# Altium schematic sheet ISB_V2.SchDoc
size A4
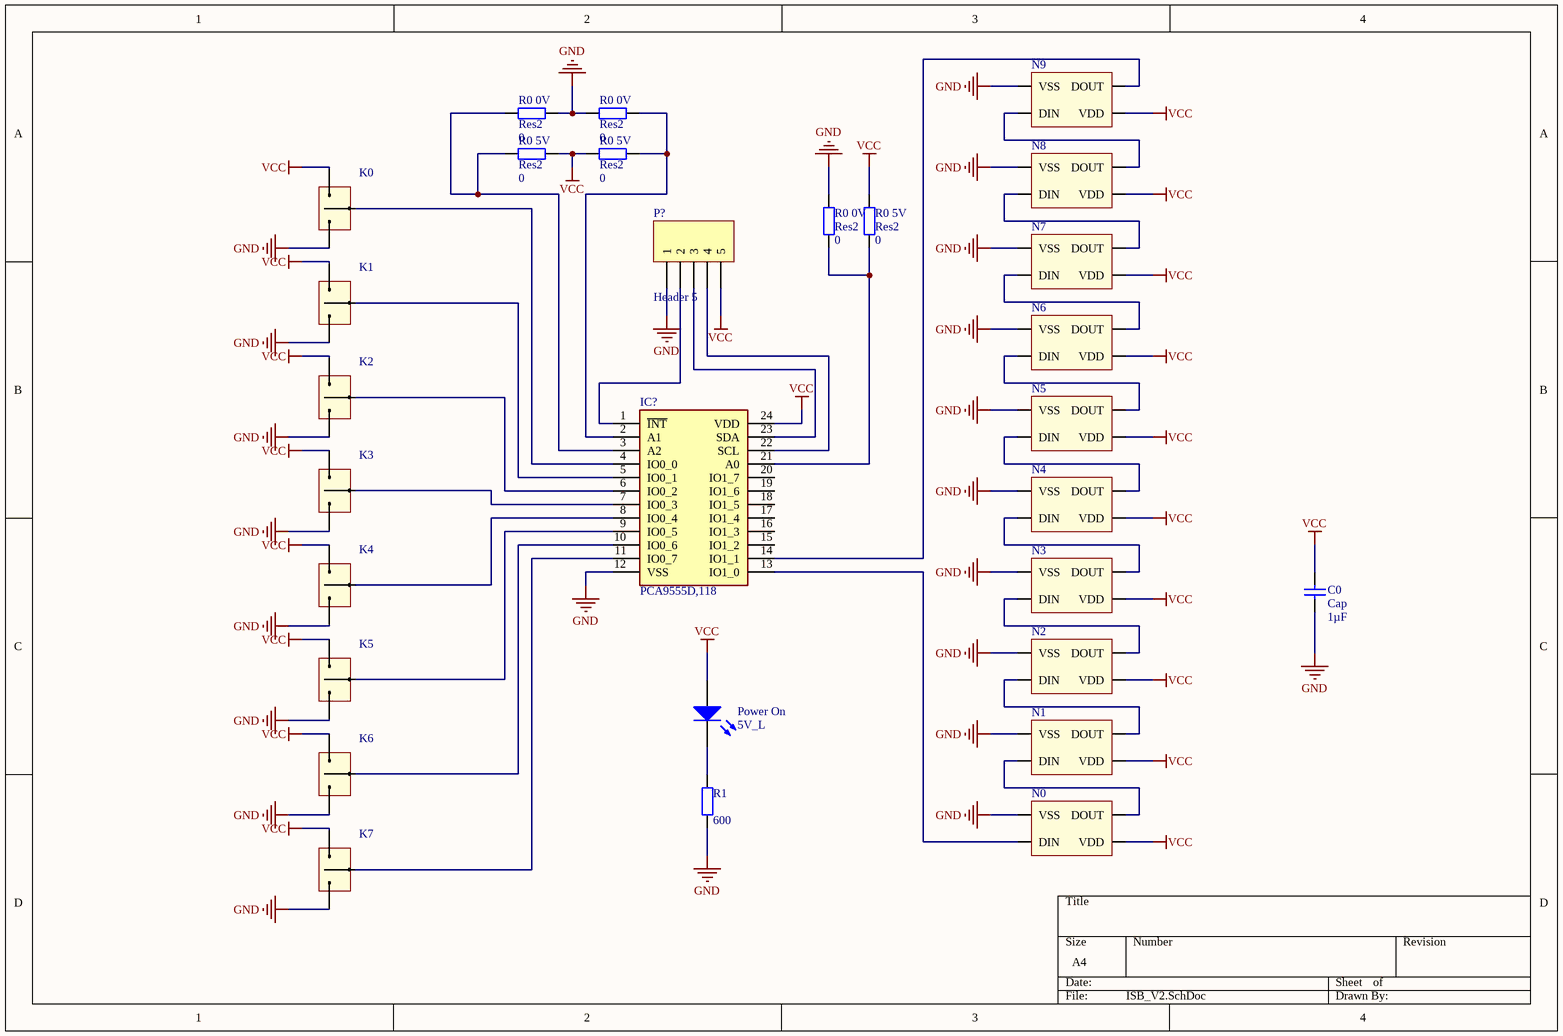
[diagram p0: ISB_V2.SchDoc]

## Parts
(Parts that share a designator on the sheet are numbered #1, #2 ... from top to bottom, then left to right.)
C0  Cap  value 1µF  [Capacitor 1206]
IC?  PCA9555D,118  [SOIC127P1032X265-24N]
K0  Switch  [SWITCH]  (value not drawn)
K1  Switch  [SWITCH]  (value not drawn)
K2  Switch  [SWITCH]  (value not drawn)
K3  Switch  [SWITCH]  (value not drawn)
K4  Switch  [SWITCH]  (value not drawn)
K5  Switch  [SWITCH]  (value not drawn)
K6  Switch  [SWITCH]  (value not drawn)
K7  Switch  [SWITCH]  (value not drawn)
N0  (no value)  [Neopixel]
N1  (no value)  [Neopixel]
N2  (no value)  [Neopixel]
N3  (no value)  [Neopixel]
N4  (no value)  [Neopixel]
N5  (no value)  [Neopixel]
N6  (no value)  [Neopixel]
N7  (no value)  [Neopixel]
N8  (no value)  [Neopixel]
N9  (no value)  [Neopixel]
P?  Header 5  [JST-XH 5]
Power_On  5V_L  [KP-3216SEC]
R0_0V#1  Res2  value 0  [Resistor 1206]
R0_0V#2  Res2  value 0  [Resistor 1206]
R0_0V#3  Res2  value 0  [Resistor 1206]
R0_5V#1  Res2  value 0  [Resistor 1206]
R0_5V#2  Res2  value 0  [Resistor 1206]
R0_5V#3  Res2  value 0  [Resistor 1206]
R1  value 600  [Resistor 1206]  (hidden comment: Res2)

## Nets
GND: C0.1 IC?.12(VSS) K0.2(R) K1.2(R) K2.2(R) K3.2(R) K4.2(R) K5.2(R) K6.2(R) K7.2(R) N0.2(VSS) N1.2(VSS) N2.2(VSS) N3.2(VSS) N4.2(VSS) N5.2(VSS) N6.2(VSS) N7.2(VSS) N8.2(VSS) N9.2(VSS) P?.1 R0_0V#1.1 R0_0V#2.2 R0_0V#3.2 R1.1
VCC: C0.2 IC?.24(VDD) K0.0(L) K1.0(L) K2.0(L) K3.0(L) K4.0(L) K5.0(L) K6.0(L) K7.0(L) N0.4(VDD) N1.4(VDD) N2.4(VDD) N3.4(VDD) N4.4(VDD) N5.4(VDD) N6.4(VDD) N7.4(VDD) N8.4(VDD) N9.4(VDD) P?.5 Power_On.1(A) R0_5V#1.2 R0_5V#2.2 R0_5V#3.2
NetIC?_1: IC?.1(~{INT}) P?.2
NetIC?_2: IC?.2(A1) R0_0V#2.1 R0_5V#2.1
NetIC?_3: IC?.3(A2) R0_0V#1.2 R0_5V#1.1
NetIC?_4: IC?.4(IO0_0) K0.1(M)
NetIC?_5: IC?.5(IO0_1) K1.1(M)
NetIC?_6: IC?.6(IO0_2) K2.1(M)
NetIC?_7: IC?.7(IO0_3) K3.1(M)
NetIC?_8: IC?.8(IO0_4) K4.1(M)
NetIC?_9: IC?.9(IO0_5) K5.1(M)
NetIC?_10: IC?.10(IO0_6) K6.1(M)
NetIC?_11: IC?.11(IO0_7) K7.1(M)
NetIC?_13: IC?.13(IO1_0) N0.3(DIN)
NetIC?_14: IC?.14(IO1_1) N9.1(DOUT)
NetIC?_21: IC?.21(A0) R0_0V#3.1 R0_5V#3.1
NetIC?_22: IC?.22(SCL) P?.4
NetIC?_23: IC?.23(SDA) P?.3
NetN0_1: N0.1(DOUT) N1.3(DIN)
NetN1_1: N1.1(DOUT) N2.3(DIN)
NetN2_1: N2.1(DOUT) N3.3(DIN)
NetN3_1: N3.1(DOUT) N4.3(DIN)
NetN4_1: N4.1(DOUT) N5.3(DIN)
NetN5_1: N5.1(DOUT) N6.3(DIN)
NetN6_1: N6.1(DOUT) N7.3(DIN)
NetN7_1: N7.1(DOUT) N8.3(DIN)
NetN8_1: N8.1(DOUT) N9.3(DIN)
NetPower_On_2: Power_On.2(K) R1.2

Not connected (* = marked no-connect by the designer): IC? 15(IO1_2) 16(IO1_3) 17(IO1_4) 18(IO1_5) 19(IO1_6) 20(IO1_7)

## Library data of the parts
C0 = Cap: Capacitor; Published: 8-Jun-2000; LatestRevisionDate: 17-Jul-2002; LatestRevisionNote: Re-released for DXP Platform.; PackageReference: RAD-0.3; Publisher: Altium Limited; PackageDescription: Radial Cap, Thru-Hole; 2 Leads; 0.3 in Pin Spacing
IC? = PCA9555D,118: Integrated Circuit; Manufacturer_Name: NXP; Datasheet Link: http://www.nxp.com/docs/en/data-sheet/PCA9555.pdf; Height: 2.65mm; Manufacturer_Part_Number: PCA9555D,118; Mouser Part Number: 771-PCA9555D-T; Mouser Price/Stock: https://www.mouser.co.uk/ProductDetail/NXP-Semiconductors/PCA9555D118?qs=LOCUfHb8d9tGZvX3C7Uu1g%3D%3D; Arrow Part Number: PCA9555D,118; Arrow Price/Stock: https://www.arrow.com/en/products/pca9555d118/nxp-semiconductors?region=nac
K0-K7 = Switch: 3 pos switch, 09.03290.01
N0-N9 = NeoPixel
P? = Header 5: Header, 5-Pin; LatestRevisionDate: 17-Jul-2002; LatestRevisionNote: Re-released for DXP Platform.; Publisher: Altium Limited
Power_On = LED2: Typical RED, GREEN, YELLOW, AMBER GaAs LED; Published: 8-Jun-2000; LatestRevisionDate: 17-Jul-2002; LatestRevisionNote: Re-released for DXP Platform.; PackageVersion: Feb-2002; PackageReference: 3.2X1.6X1.1; Publisher: Altium Limited; PackageDescription: SM LED; 2 Flat Leads
R0_0V#1-R0_0V#3 R0_5V#1-R0_5V#3 R1 = Res2: Resistor; Published: 8-Jun-2000; LatestRevisionDate: 17-Jul-2002; LatestRevisionNote: Re-released for DXP Platform.; PackageReference: AXIAL-0.4; Publisher: Altium Limited; PackageDescription: Axial Device, Thru-Hole; 2 Leads; 0.4 in Pin Spacing